# EasyEDA schematic SCH_Logette connecté_2023-11-30.json
TITLE: Logette Connecté; REV: 1.0; Date: 2023-11-04; Sheet: 1/1; Drawn By: Jephte Lumaka; Company: Lumaka Engineering
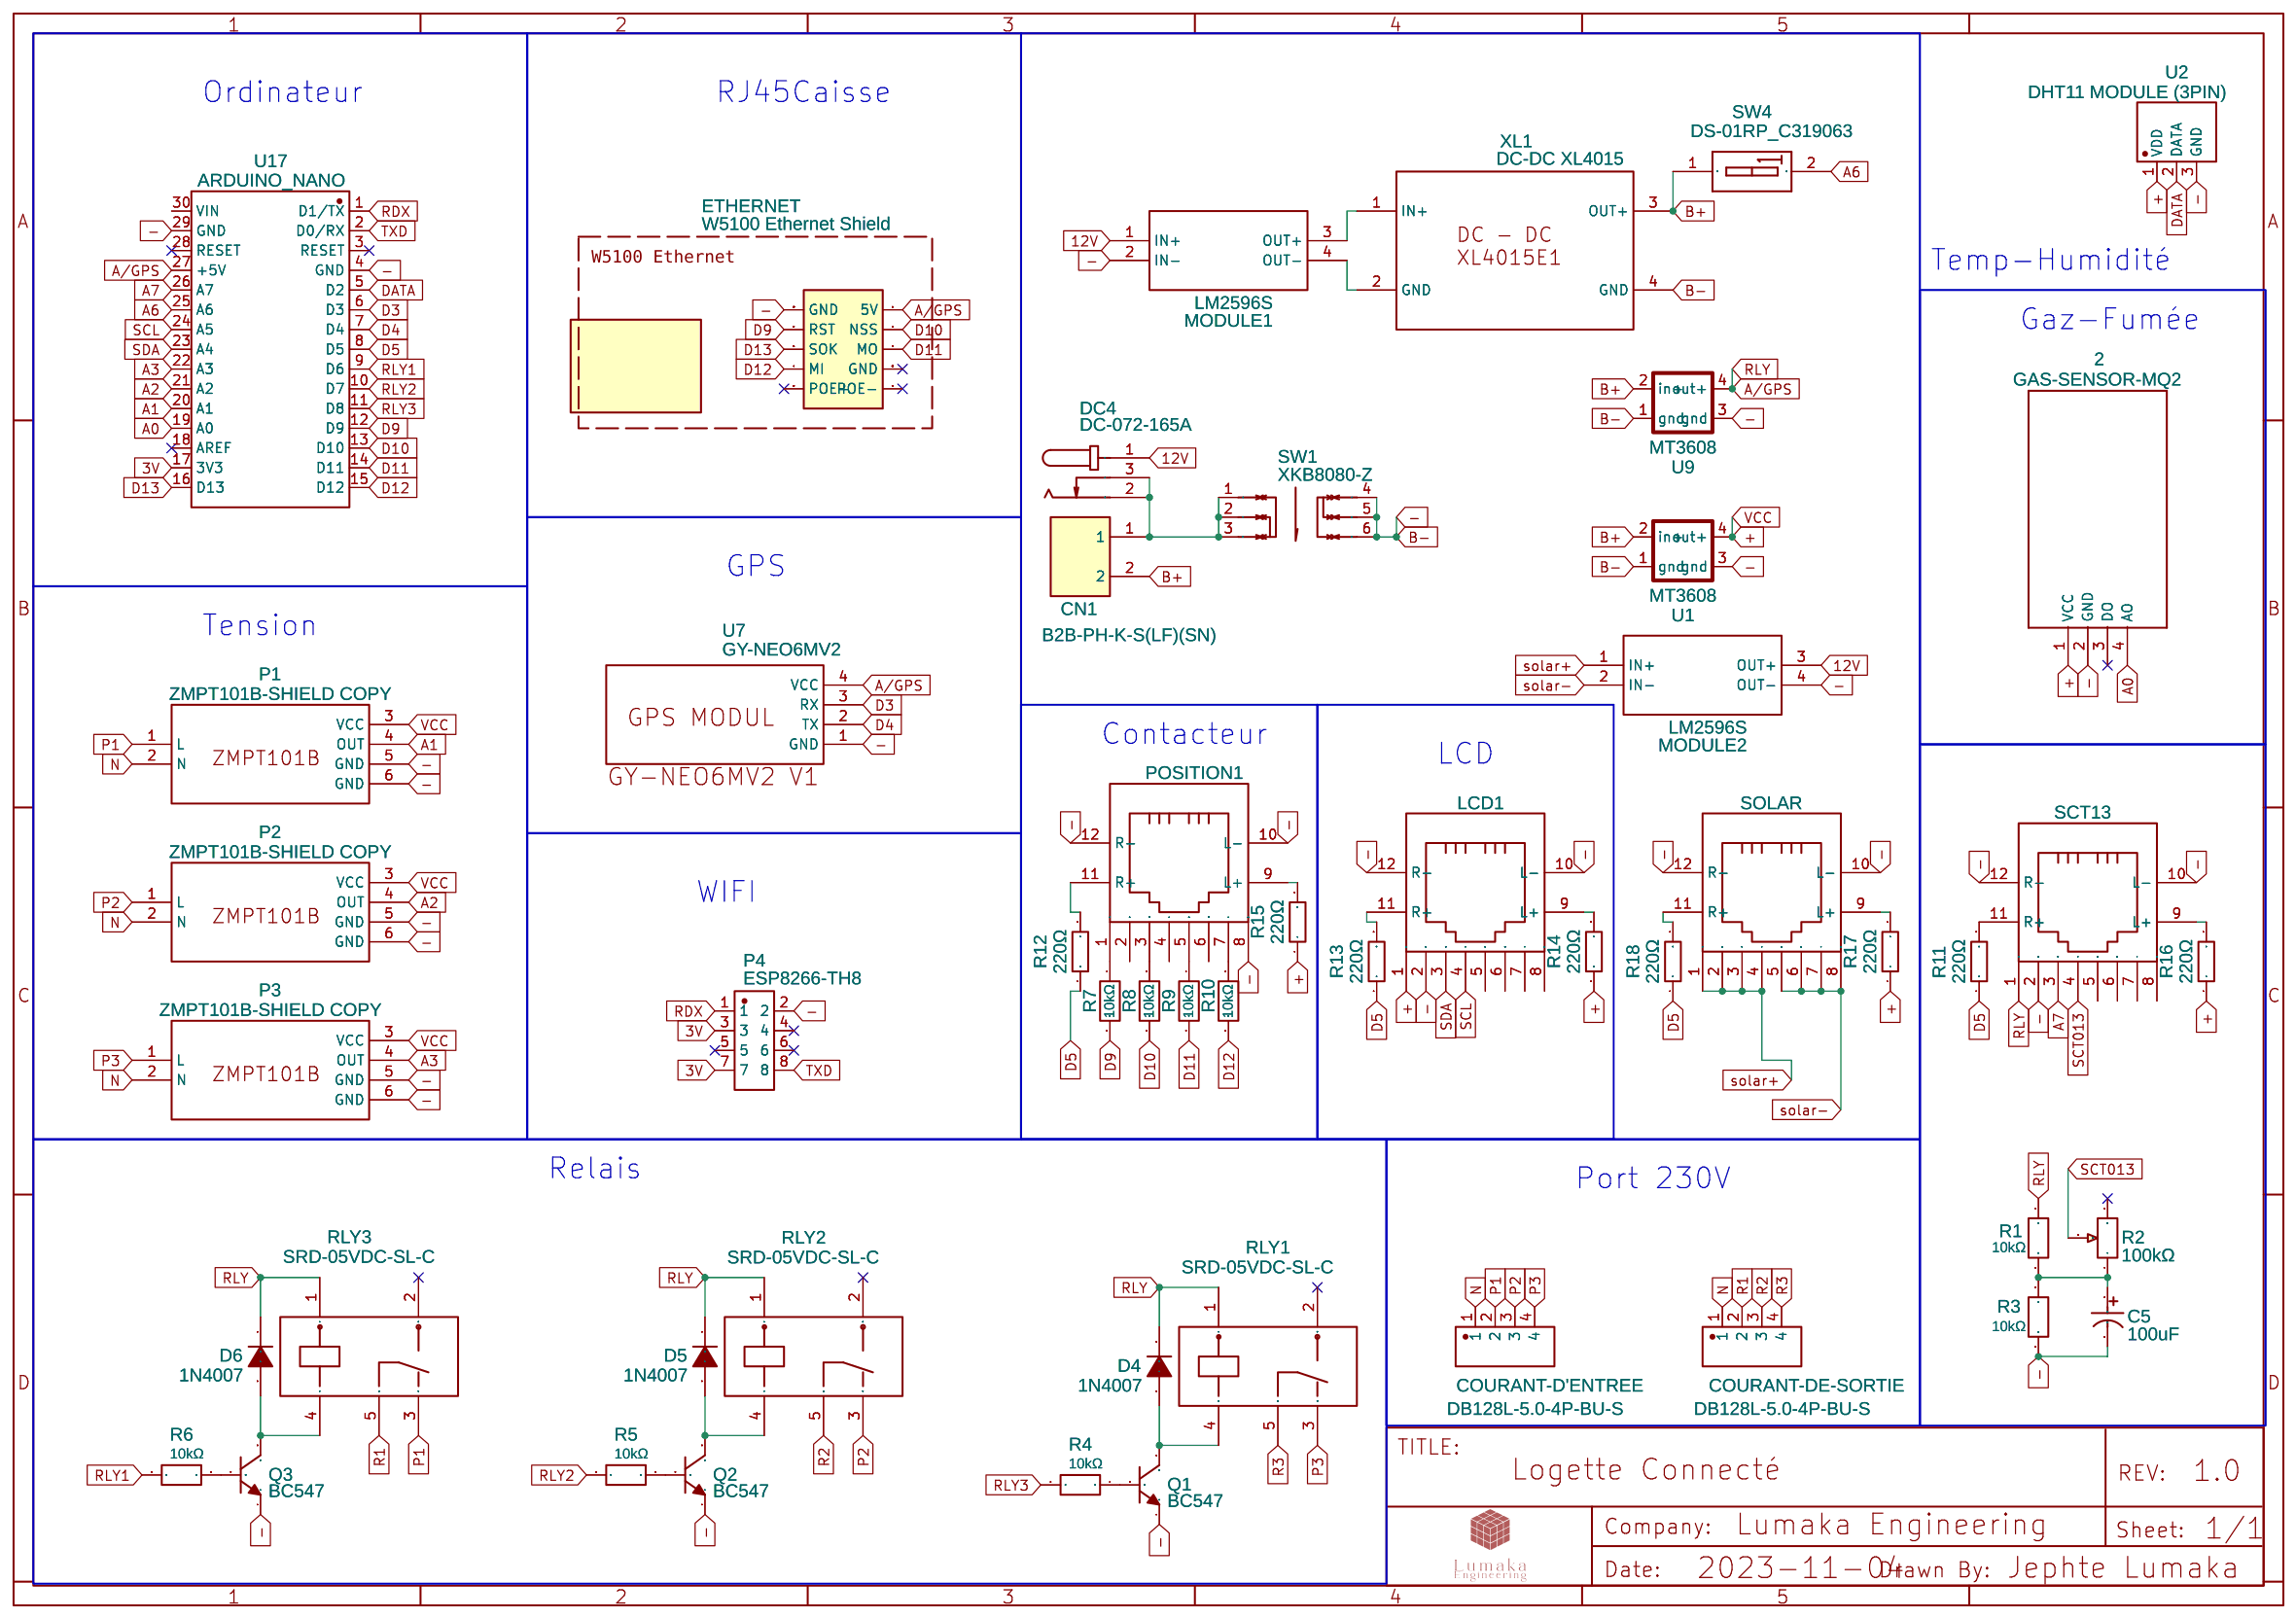
[diagram p0: schematic sheet]

## Parts
2  GAS-SENSOR-MQ2  [GAS-SENSOR-MQ2]
C5  100uF  [CAP-SMD_BD6.3-L6.6-W6.6-FD]
CN1  B2B-PH-K-S(LF)(SN)  [CONN-TH_B2B-PH-K-S]
COURANT-D'ENTREE  DB128L-5.0-4P-BU-S  [CONN-TH_4P-5.00_DB128L-5.0-4P-BU-S]
COURANT-DE-SORTIE  DB128L-5.0-4P-BU-S  [CONN-TH_4P-5.00_DB128L-5.0-4P-BU-S]
D4  1N4007  [DO-41_BD2.4-L4.7-P8.70-D0.9-RD]
D5  1N4007  [DO-41_BD2.4-L4.7-P8.70-D0.9-RD]
D6  1N4007  [DO-41_BD2.4-L4.7-P8.70-D0.9-RD]
DC4  DC-072-165A  [DC-IN-TH_DC-072-165A]
ETHERNET  W5100 Ethernet Shield  [W5100 ETHERNET MINI]
LCD1  MJ5688-Y011-GRNL1  [RJ45-TH_MJ5688-Y011-GRNL1]
MODULE1  LM2596S  [LM2596S]
MODULE2  LM2596S  [LM2596S]
P1  ZMPT101B-SHIELD COPY  [ZMPT101B-MODULE]
P2  ZMPT101B-SHIELD COPY  [ZMPT101B-MODULE]
P3  ZMPT101B-SHIELD COPY  [ZMPT101B-MODULE]
P4  ESP8266-TH8  [HDR-TH_8P-P2.54-V-F-R2-C4-S2.54-1]
POSITION1  MJ5688-Y011-GRNL1  [RJ45-TH_MJ5688-Y011-GRNL1]
Q1  BC547  [TO92C]
Q2  BC547  [TO92C]
Q3  BC547  [TO92C]
R1  10kΩ  [RES-TH_BD2.3-L6.5-P10.50-D0.5]
R2  100kΩ  [RES-ADJ-TH_3P-L9.5-W4.9-P2.50-L_3296W]
R3  10kΩ  [RES-TH_BD2.3-L6.5-P10.50-D0.5]
R4  10kΩ  [RES-TH_BD2.3-L6.5-P10.50-D0.5]
R5  10kΩ  [RES-TH_BD2.3-L6.5-P10.50-D0.5]
R6  10kΩ  [RES-TH_BD2.3-L6.5-P10.50-D0.5]
R7  10kΩ  [RES-TH_BD2.3-L6.5-P10.50-D0.5]
R8  10kΩ  [RES-TH_BD2.3-L6.5-P10.50-D0.5]
R9  10kΩ  [RES-TH_BD2.3-L6.5-P10.50-D0.5]
R10  10kΩ  [RES-TH_BD2.3-L6.5-P10.50-D0.5]
R11  220Ω  [RES-TH_BD2.2-L6.5-P10.50-D0.6]
R12  220Ω  [RES-TH_BD2.2-L6.5-P10.50-D0.6]
R13  220Ω  [RES-TH_BD2.2-L6.5-P10.50-D0.6]
R14  220Ω  [RES-TH_BD2.2-L6.5-P10.50-D0.6]
R15  220Ω  [RES-TH_BD2.2-L6.5-P10.50-D0.6]
R16  220Ω  [RES-TH_BD2.2-L6.5-P10.50-D0.6]
R17  220Ω  [RES-TH_BD2.2-L6.5-P10.50-D0.6]
R18  220Ω  [RES-TH_BD2.2-L6.5-P10.50-D0.6]
RLY1  SRD-05VDC-SL-C  [RELAY-TH_SRD-XXVDC-XL-C]
RLY2  SRD-05VDC-SL-C  [RELAY-TH_SRD-XXVDC-XL-C]
RLY3  SRD-05VDC-SL-C  [RELAY-TH_SRD-XXVDC-XL-C]
SCT13  MJ5688-Y011-GRNL1  [RJ45-TH_MJ5688-Y011-GRNL1]
SOLAR  MJ5688-Y011-GRNL1  [RJ45-TH_MJ5688-Y011-GRNL1]
SW1  XKB8080-Z  [SW-TH_6P-L8.0-W8.0-P2.50]
SW4  DS-01RP_C319063  [SW-TH_DS-01RP]
U1  MT3608  [MT3608]
U2  DHT11 MODULE (3PIN)  [DHT11 MODULE 3P]
U7  GY-NEO6MV2  [GY-NEO6MV2]
U9  MT3608  [MT3608]
U17  ARDUINO_NANO  [COMM-TH_ARDUINO_NANO]
XL1  DC-DC XL4015  [DC-DC_XL4015_5A]

## Library data of the parts
2 = GAS-SENSOR-MQ2: Contributor: osorobevon123
C5 = UWX1C101MCL1GB: Supplier: LCSC; Manufacturer: Nichicon(尼吉康); Supplier Part: C111600; JLCPCB Part Class: Extended Part
CN1 = B2B-PH-K-S(LF)(SN): Contributor: LCSC; Supplier: LCSC; Manufacturer: JST; Supplier Part: C131337; JLCPCB Part Class: Extended Part; link: https://lcsc.com/eda_search?q=C131337&%26type=1&ref=editor
COURANT-D'ENTREE COURANT-DE-SORTIE = DB128L-5.0-4P-BU-S: Supplier: LCSC; Supplier Part: C430599; Manufacturer: DIBO(地博电气); Contributor: LCSC; JLCPCB Part Class: Extended Part
D4-D6 = 1N4007E-E3/54: Supplier: LCSC; Manufacturer: VISHAY(威世); Contributor: LCSC; Supplier Part: C144970; JLCPCB Part Class: Extended Part
DC4 = DC-072-165A: Supplier: LCSC; Manufacturer: HRO; Supplier Part: C129003
ETHERNET = W5100 Ethernet Shield: Contributor: DavidQ
LCD1 POSITION1 SCT13 SOLAR = MJ5688-Y011-GRNL1: Supplier: LCSC; Supplier Part: C501470; Manufacturer: Heling(合陵); Contributor: LCSC; JLCPCB Part Class: Extended Part
MODULE1 MODULE2 = LM2596S: Manufacturer Part: LM2596; link: http://www.alldatasheet.com/datasheet-pdf/pdf/8744/NSC/LM2596.html; Contributor: Jonatan Arango Gomez
P1-P3 = ZMPT101B-SHIELD COPY: Manufacturer: sterling; Supplier: LCSC; link: https://lcsc.com/product-detail/Current-Transformers_Qingxian-Zeming-Langxi-Elec-ZMPT101B_C111858.html; Contributor: Bosco_Sterling
P4 = ESP8266-TH8: Supplier: LCSC; Supplier Part: C9900003199; Manufacturer: null; JLCPCB Part Class: Extended Part; Contributor: LCSC
Q1-Q3 = BC547COPY: sourceId: vnaKWUSsp; sim: true; Contributor: elifnur.ozcan
R1 R3-R10 = MF1/4W-100KΩ±1%T52: Supplier: LCSC; Supplier Part: C714036; Manufacturer: Huaxing Mechanical-Elec.; Contributor: LCSC; JLCPCB Part Class: Extended Part; Resistance: 100kΩ
R2 = 3296W-1-104: Supplier: LCSC; Supplier Part: C118963; Manufacturer: BOCHEN(博晨); Resistance(Ohms): 100K; Contributor: LCSC; Resistance (Ohms): 100K; JLCPCB Part Class: Extended Part
R11-R18 = MFR0W4F2200A50: Supplier: LCSC; Manufacturer: UNI-ROYAL(厚声); Supplier Part: C57439; JLCPCB Part Class: Extended Part; link: https://lcsc.com/eda_search?q=C57439&%26type=1&ref=editor
RLY1-RLY3 = SRD-05VDC-SL-C: Supplier: LCSC; Manufacturer: 松乐; Supplier Part: C35449; JLCPCB Part Class: Extended Part
SW1 = XKB8080-Z: Contributor: LCSC; Supplier: LCSC; Supplier Part: C318860; Manufacturer: XKB Enterprise; JLCPCB Part Class: Extended Part; link: https://lcsc.com/eda_search?q=C318860&%26type=1&ref=editor
SW4 = DS-01RP_C319063: Supplier: LCSC; Supplier Part: C319063; Manufacturer: XKB Enterprise; Manufacturer Part: DS-01RP; Contributor: LCSC; JLCPCB Part Class: Extended Part
U1 U9 = dc dc: Manufacturer Part: dc/dc; Contributor: Ripleigh
U2 = DHT11 MODULE (3PIN): Supplier: LCSC; Supplier Part: C117051; Manufacturer: Aosong (Guangzhou) Elec; Manufacturer Part: DHT11; Contributor: danishjr.hd
U7 = GY-NEO6MV2: Contributor: Alex Fedosov
U17 = ARDUINO_NANO: Supplier: LCSC; Supplier Part: C9900017879; Manufacturer: null; JLCPCB Part Class: Extended Part; Contributor: lcsc
XL1 = DC-DC XL4015: Contributor: Николай Суриков

## Nets
3V: P4.3 P4.7 U17.17(3V3)
12V: DC4.1 MODULE1.1(IN+) MODULE2.3(OUT+)
+: 2.1(VCC) LCD1.1 P1.3(VCC) P2.3(VCC) P3.3(VCC) R14.1 R15.1 R16.1 R17.1 U1.4(out+) U2.1(VDD)
-: 2.2(GND) C5.2 ETHERNET.GND_1(GND) LCD1.2 LCD1.10(L-) LCD1.12(R-) MODULE1.2(IN-) MODULE2.4(OUT-) P1.5(GND) P1.6(GND) P2.5(GND) P2.6(GND) P3.5(GND) P3.6(GND) P4.2 POSITION1.8 POSITION1.10(L-) POSITION1.12(R-) Q1.1(E) Q2.1(E) Q3.1(E) R3.2 SCT13.2 SCT13.10(L-) SCT13.12(R-) SOLAR.10(L-) SOLAR.12(R-) SW1.4 SW1.5 SW1.6 U1.1(gnd) U1.3(gnd) U2.3(GND) U7.1(GND) U9.1(gnd) U9.3(gnd) U17.4(GND) U17.29(GND) XL1.4(GND)
A0: 2.4(AO) U17.19(A0)
A1: P1.4(OUT) U17.20(A1)
A2: P2.4(OUT) U17.21(A2)
A3: P3.4(OUT) U17.22(A3)
A6: SW4.2(A2) U17.25(A6)
A7: SCT13.3 U17.26(A7)
A/GPS: D4.1(K) D5.1(K) D6.1(K) ETHERNET.5V R1.1 RLY1.1 RLY2.1 RLY3.1 SCT13.1 U7.4(VCC) U9.4(out+) U17.27(+5V)
B+: CN1.2 SW4.1(A1) U1.2(in+) U9.2(in+) XL1.3(OUT+)
D3: U7.3(RX) U17.6(D3)
D4: U7.2(TX) U17.7(D4)
D5: R11.1 R12.1 R13.1 R18.1 U17.8(D5)
D9: ETHERNET.RST R7.2 U17.12(D9)
D10: ETHERNET.NSS R8.2 U17.13(D10)
D11: ETHERNET.MO R9.2 U17.14(D11)
D12: ETHERNET.MI R10.2 U17.15(D12)
D13: ETHERNET.SOK U17.16(D13)
DATA: U2.2(DATA) U17.5(D2)
N: COURANT-D'ENTREE.1 COURANT-DE-SORTIE.1 P1.2(N) P2.2(N) P3.2(N)
P1: COURANT-D'ENTREE.2 P1.1(L) RLY3.3
P2: COURANT-D'ENTREE.3 P2.1(L) RLY2.3
P3: COURANT-D'ENTREE.4 P3.1(L) RLY1.3
R1: COURANT-DE-SORTIE.2 RLY3.5
R2: COURANT-DE-SORTIE.3 RLY2.5
R3: COURANT-DE-SORTIE.4 RLY1.5
RDX: P4.1 U17.1(D1/TX)
RLY1: R6.2 U17.9(D6)
RLY2: R5.2 U17.10(D7)
RLY3: R4.2 U17.11(D8)
SCL: LCD1.4 U17.24(A5)
SCT013: R2.2 SCT13.4
SDA: LCD1.3 U17.23(A4)
solar+: MODULE2.1(IN+) SOLAR.1 SOLAR.2 SOLAR.3 SOLAR.4
solar-: MODULE2.2(IN-) SOLAR.5 SOLAR.6 SOLAR.7 SOLAR.8
TXD: P4.8 U17.2(D0/RX)
Net-(C5-1): C5.1 R1.2 R2.1 R3.1
Net-(CN1-1): CN1.1 DC4.2 DC4.3 SW1.1 SW1.2 SW1.3
Net-(D4-2): D4.2(A) Q1.3(C) RLY1.4
Net-(D5-2): D5.2(A) Q2.3(C) RLY2.4
Net-(D6-2): D6.2(A) Q3.3(C) RLY3.4
Net-(LCD1-9): LCD1.9(L+) R14.2
Net-(LCD1-11): LCD1.11(R+) R13.2
Net-(MODULE1-3): MODULE1.3(OUT+) XL1.1(IN+)
Net-(MODULE1-4): MODULE1.4(OUT-) XL1.2(GND)
Net-(POSITION1-1): POSITION1.1 R7.1
Net-(POSITION1-3): POSITION1.3 R8.1
Net-(POSITION1-5): POSITION1.5 R9.1
Net-(POSITION1-7): POSITION1.7 R10.1
Net-(POSITION1-9): POSITION1.9(L+) R15.2
Net-(POSITION1-11): POSITION1.11(R+) R12.2
Net-(Q1-2): Q1.2(B) R4.1
Net-(Q2-2): Q2.2(B) R5.1
Net-(Q3-2): Q3.2(B) R6.1
Net-(R11-2): R11.2 SCT13.11(R+)
Net-(R16-2): R16.2 SCT13.9(L+)
Net-(R17-2): R17.2 SOLAR.9(L+)
Net-(R18-2): R18.2 SOLAR.11(R+)

Not connected (* = marked no-connect by the designer): 2 3(DO)*; ETHERNET GND_2(GND)* POE+* POE-*; LCD1 5 6 7 8; P4 4* 5* 6*; POSITION1 2 4 6; R2 3*; RLY1 2*; RLY2 2*; RLY3 2*; SCT13 5 6 7 8; U17 3(RESET)* 18(AREF)* 28(RESET)* 30(VIN)

## Notes on the sheet
- Ordinateur
- RJ45Caisse
- Temp-Humidité
- Gaz-Fumée
- GPS
- Tension
- Contacteur
- LCD
- WIFI
- Relais
- Port 230V
